# Altium schematic sheet vfd_archive.SchDoc
size C; SheetNumber: 2; SheetTotal: 2
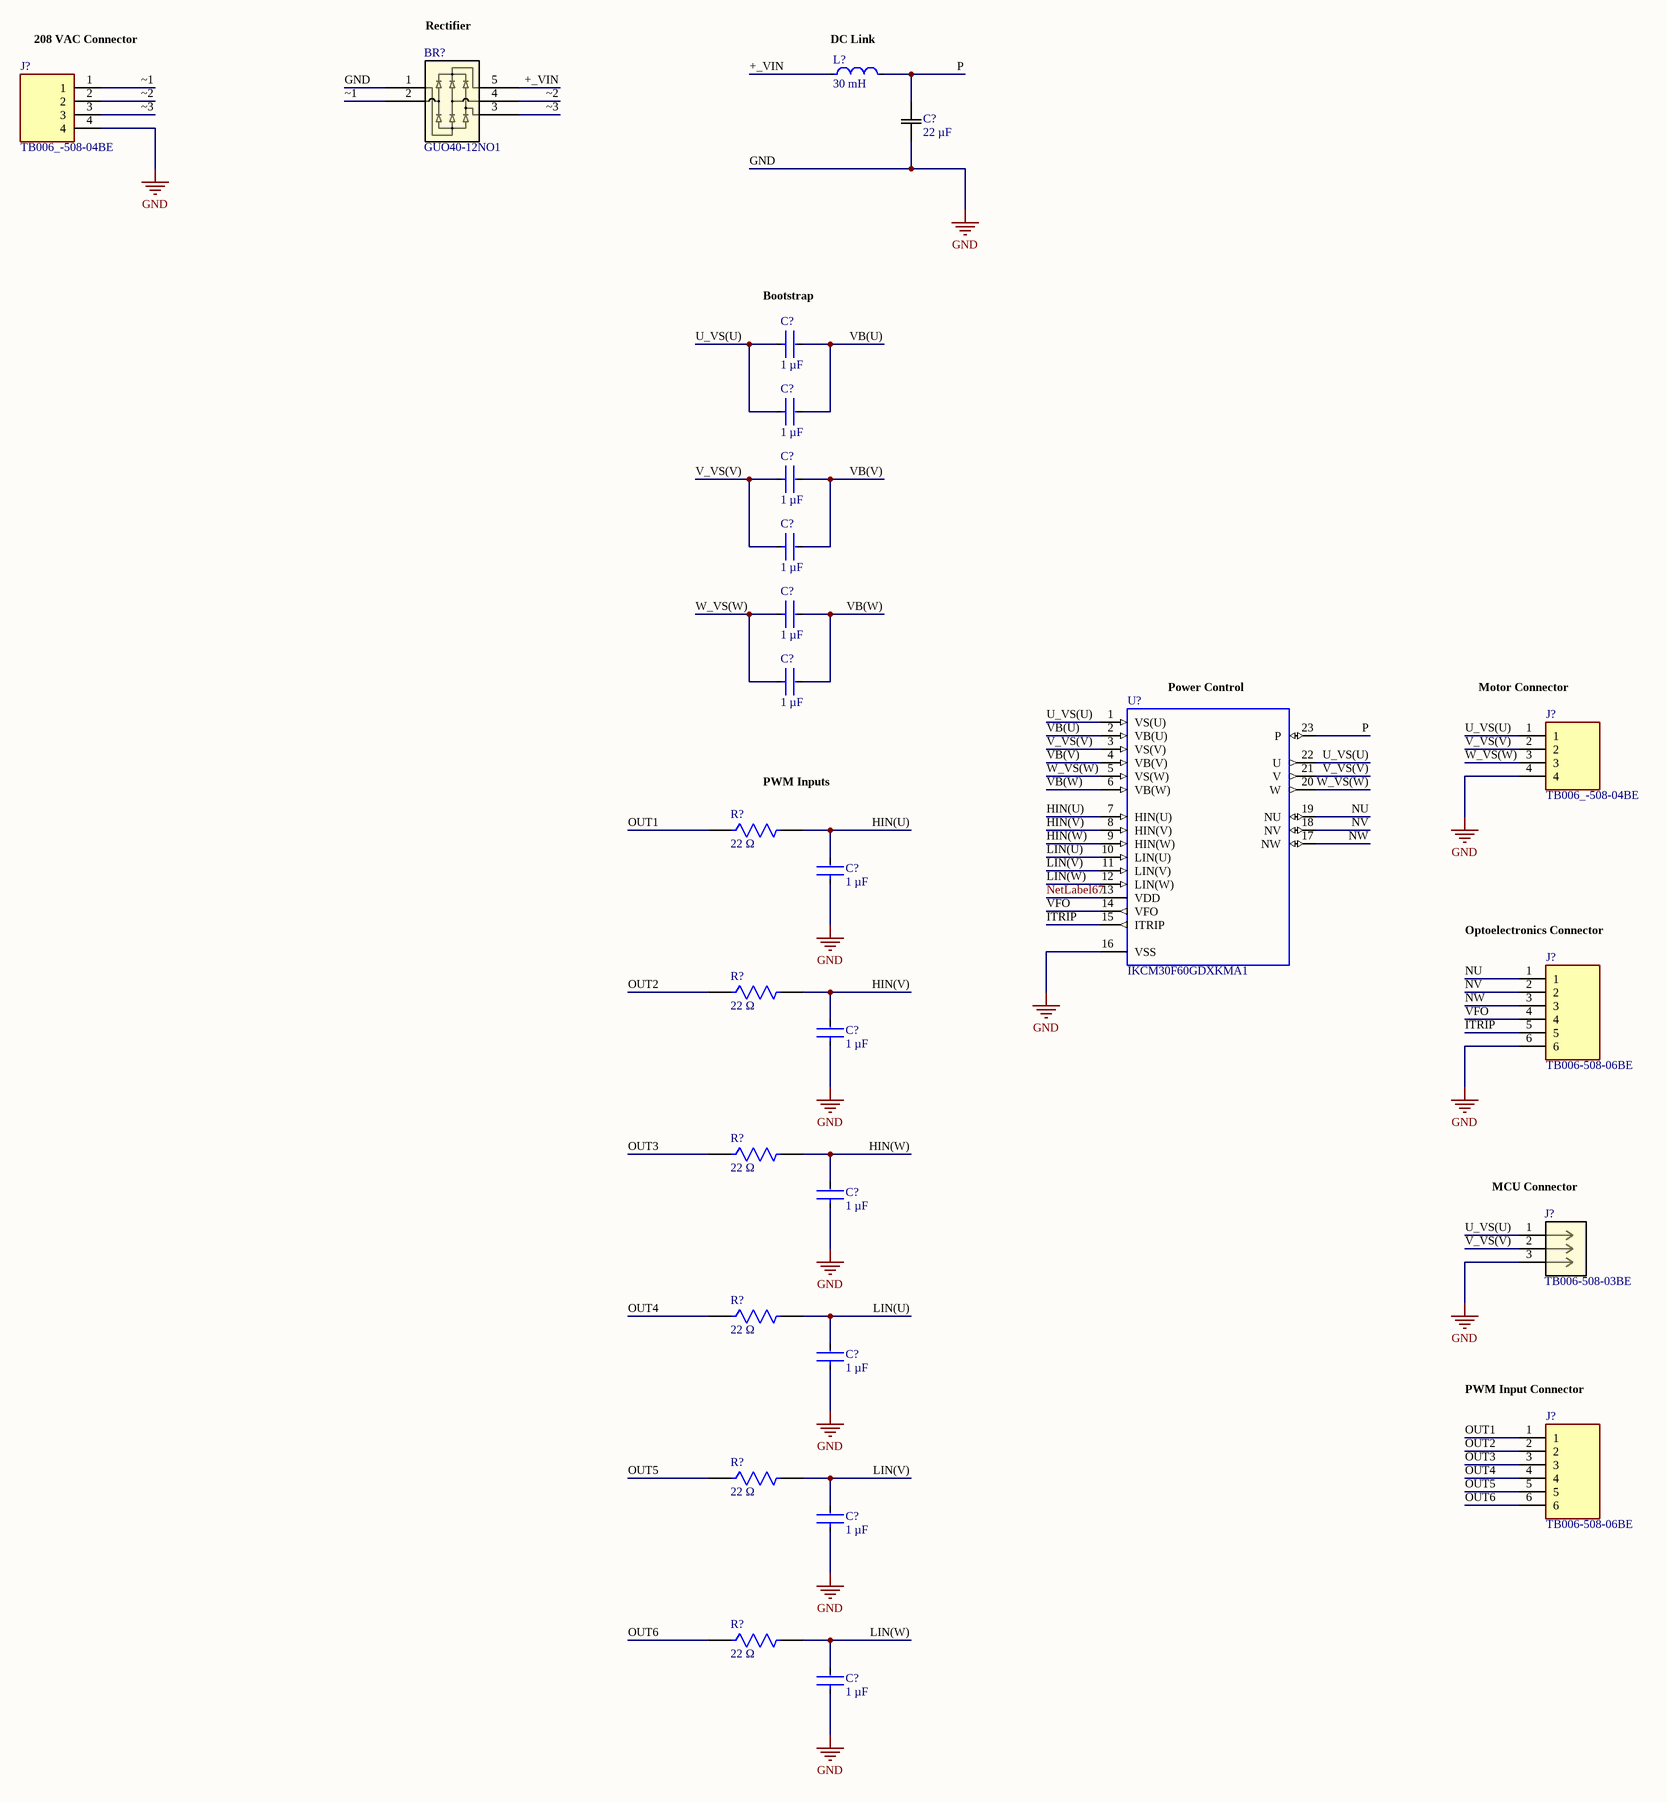
[diagram p0: vfd_archive.SchDoc]

## Parts
(Parts that share a designator on the sheet are numbered #1, #2 ... from top to bottom, then left to right.)
BR?  GUO40-12NO1  [SIP5-GUFP_LTF]
C?#1  22 µF  [CAP_BX_12P5x20_RUB]
C?#2  1 µF  [FP-CL21-IPC_B]
C?#3  1 µF  [FP-CL21-IPC_B]
C?#4  1 µF  [FP-CL21-IPC_B]
C?#5  1 µF  [FP-CL21-IPC_B]
C?#6  1 µF  [FP-CL21-IPC_B]
C?#7  1 µF  [FP-CL21-IPC_B]
C?#8  1 µF  [FP-CL21-IPC_B]
C?#9  1 µF  [FP-CL21-IPC_B]
C?#10  1 µF  [FP-CL21-IPC_B]
C?#11  1 µF  [FP-CL21-IPC_B]
C?#12  1 µF  [FP-CL21-IPC_B]
C?#13  1 µF  [FP-CL21-IPC_B]
J?#1  TB006_-508-04BE  [CUI_TB006 -508-04BE]
J?#2  TB006_-508-04BE  [CUI_TB006 -508-04BE]
J?#3  TB006-508-06BE  [CUI_TB006-508-06BE]
J?#4  TB006-508-03BE  [CONN3_TB006-508_CUD]
J?#5  TB006-508-06BE  [CUI_TB006-508-06BE]
L?  30 mH  [FP-LQH43CN_03-MFG]
R?#1  22 Ω  [FP-MCR006-MFG]
R?#2  22 Ω  [FP-MCR006-MFG]
R?#3  22 Ω  [FP-MCR006-MFG]
R?#4  22 Ω  [FP-MCR006-MFG]
R?#5  22 Ω  [FP-MCR006-MFG]
R?#6  22 Ω  [FP-MCR006-MFG]
U?  IKCM30F60GDXKMA1  [IC_IKCM30F60GDXKMA1]

## Nets
GND: BR?.1 C?#1.1 C?#8.1 C?#9.1 C?#10.1 C?#11.1 C?#12.1 C?#13.1 J?#1.4 J?#2.4 J?#3.6 J?#4.3 U?.16(VSS)
+_VIN: BR?.5 L?.1
HIN(U): C?#8.2 R?#1.2 U?.7(HIN(U))
HIN(V): C?#9.2 R?#2.2 U?.8(HIN(V))
HIN(W): C?#10.2 R?#3.2 U?.9(HIN(W))
ITRIP: J?#3.5 U?.15(ITRIP)
LIN(U): C?#11.2 R?#4.2 U?.10(LIN(U))
LIN(V): C?#12.2 R?#5.2 U?.11(LIN(V))
LIN(W): C?#13.2 R?#6.2 U?.12(LIN(W))
NetLabel67: U?.13(VDD)
NU: J?#3.1 U?.19(NU)
NV: J?#3.2 U?.18(NV)
NW: J?#3.3 U?.17(NW)
OUT1: J?#5.1 R?#1.1
OUT2: J?#5.2 R?#2.1
OUT3: J?#5.3 R?#3.1
OUT4: J?#5.4 R?#4.1
OUT5: J?#5.5 R?#5.1
OUT6: J?#5.6 R?#6.1
P: C?#1.2 L?.2 U?.23(P)
U_VS(U): C?#2.1 C?#3.1 J?#2.1 J?#4.1 U?.1(VS(U)) U?.22(U)
V_VS(V): C?#4.1 C?#5.1 J?#2.2 J?#4.2 U?.3(VS(V)) U?.21(V)
VB(U): C?#2.2 C?#3.2 U?.2(VB(U))
VB(V): C?#4.2 C?#5.2 U?.4(VB(V))
VB(W): C?#6.2 C?#7.2 U?.6(VB(W))
VFO: J?#3.4 U?.14(VFO)
W_VS(W): C?#6.1 C?#7.1 J?#2.3 U?.5(VS(W)) U?.20(W)
~1: BR?.2 J?#1.1
~2: BR?.4 J?#1.2
~3: BR?.3 J?#1.3

## Notes on the sheet
- (near J?#1) 208 VAC Connector
- Rectifier
- (near L?) DC Link
- (near C?#2) Bootstrap
- (near U?) Power Control
- (near J?#2) Motor Connector
- (near R?#1) PWM Inputs
- (near J?#3) Optoelectronics Connector
- (near J?#4) MCU Connector
- (near J?#5) PWM Input Connector

## Library data of the parts
BR? = GUO40-12NO1: No Description Available; Mfr_Name: Littelfuse Inc; RefDes: RefDes; Type: Type
C?#1 = 450BXW22MEFR12.5X20: No Description Available; Mfr_Name: Rubycon
C?#2-C?#13 = CMP-13271-002018-1: CL21 Series 0805 1uF 25V -20/+80% Tolerance Y5V Multilayer Ceramic Chip Capacitor; Tolerance: 80%; Voltage Rating: 25V; Voltage Rating (DC): 25V; Capacitance: 1uF; Thickness: 0.053inch; Radiation Hardening: No; Width: 0.049inch; Height: 1.25mm; Max Operating Temperature: 85°C; Mount: Surface Mount; Package Quantity: 10000; Depth: 1.25mm; Min Operating Temperature: -30°C; Packaging: Tape and Reel; Case/Package: 0805; Length: 2mm; Dielectric: Y5V
J?#1 J?#2 = TB006_-508-04BE: 2~24 Poles, Screw Type, Horizontal, 5.08 Pitch, 26~14 (AWG), Terminal Block Connector; MP: TB006 -508-04BE; MF: CUI Devices; SnapEDA_Link: https://www.snapeda.com/parts/TB006%20-508-04BE/CUI+Devices/view-part/?ref=snap; Availability: In Stock; CUI_purchase_URL: https://www.cuidevices.com/product/interconnect/connectors/terminal-blocks/tb006-508-series?utm_source=snapeda.com&utm_medium=referral&utm_campaign=snapedaBOM; Check_prices: https://www.snapeda.com/parts/TB006%20-508-04BE/CUI+Devices/view-part/?ref=eda; Value: *; Purchase-URL: https://pricing.snapeda.com/search/part/TB006 -508-04BE/?ref=eda; Package: None; Price: None
J?#3 J?#5 = TB006-508-06BE: 2~24 Poles, Screw Type, Horizontal, 5.08 Pitch, 26~14 (AWG), Terminal Block Connector; MF: CUI Devices; Value: *; MP: TB006-508-06BE; Purchase-URL: https://pricing.snapeda.com/search/part/TB006-508-06BE/?ref=eda; Check_prices: https://www.snapeda.com/parts/TB006-508-06BE/CUI+Devices/view-part/?ref=eda; SnapEDA_Link: https://www.snapeda.com/parts/TB006-508-06BE/CUI+Devices/view-part/?ref=snap; Digi-Key_Part_Number: 102-6195-ND; CUI_purchase_URL: https://www.cuidevices.com/product/interconnect/connectors/terminal-blocks/tb006-508-series?utm_source=snapeda.com&utm_medium=referral&utm_campaign=snapedaBOM; Package: None
J?#4 = TB006-508-03BE: No Description Available; Mfr_Name: Same Sky; Type: Wire to Board; RefDes: RefDes
L? = CMP-06042-005793-1: Wire Wound Ferrite Inductor for General Circuits 220μH ±10% 5.4Ω 110mA 1812; Self Resonant Frequency: 4.5MHz; Current: 220mA; Test Frequency: 1MHz; Series Resistance: 5.4R; Q Factor: 40; Shielding: Unshielded; Inductance: 220uH; Max Operating Temperature: 85°C; Max DC Current: 110mA; Width: 3.2mm; Case Code (Imperial): 1812; Termination: SMD/SMT; Packaging: Tape and Reel; Frequency: 4.5MHz; Inductance Tolerance: 10%; Radiation Hardening: No; Core Material: Ferrite; Lead Free: Lead Free; Depth: 3.4mm; DC Resistance (DCR): 5.4R; Military Standard: Not; Case Code (Metric): 4532; Case/Package: 1812; Package Quantity: 500; Height: 2.6mm; DC Current: 110mA; REACH SVHC: No SVHC; Weight: 0.004586oz; Current Rating: 110mA; Mount: Surface Mount; Length: 4.5mm; Tolerance: 10%; Min Operating Temperature: -40°C
R?#1-R?#6 = CMP-08839-021281-1: Thick Film Chip Resistor, 0201, 22Ω, 5%, 200ppm/°C, 0.05W, 25V; Resistance: 22R; Max Power Dissipation: 50mW; Temperature Coefficient: 250ppm/°C; Max Operating Temperature: 125°C; Height: 0.01inch; Case Code (Metric): 0603; Width: 0.012inch; Package Quantity: 1; Case/Package: 0201; Length: 0.024inch; Min Operating Temperature: -55°C; Tolerance: 5%; Resistor Type: Thick Film; Number of Terminations: 2; Series: MCR; Case Code (Imperial): 0201; Packaging: Tape and Reel; RoHS Compliant: Yes; Voltage Rating (DC): 25V
U? = IKCM30F60GDXKMA1: Fully isolated Dual In-Line molded module; MF: Infineon Technologies; Package: PowerDIP-24 Infineon; Price: None; Check_prices: https://www.snapeda.com/parts/IKCM30F60GDXKMA1/Infineon+Technologies/view-part/?ref=eda; Value: *; SnapEDA_Link: https://www.snapeda.com/parts/IKCM30F60GDXKMA1/Infineon+Technologies/view-part/?ref=snap; MP: IKCM30F60GDXKMA1; Availability: In Stock; Purchase-URL: https://pricing.snapeda.com/search?q=IKCM30F60GDXKMA1&ref=eda